# Altium schematic sheet fpga_bank34.SchDoc: FPGA Bank 34
size A4; Organization: GPA Robotics; Revision: REV 0
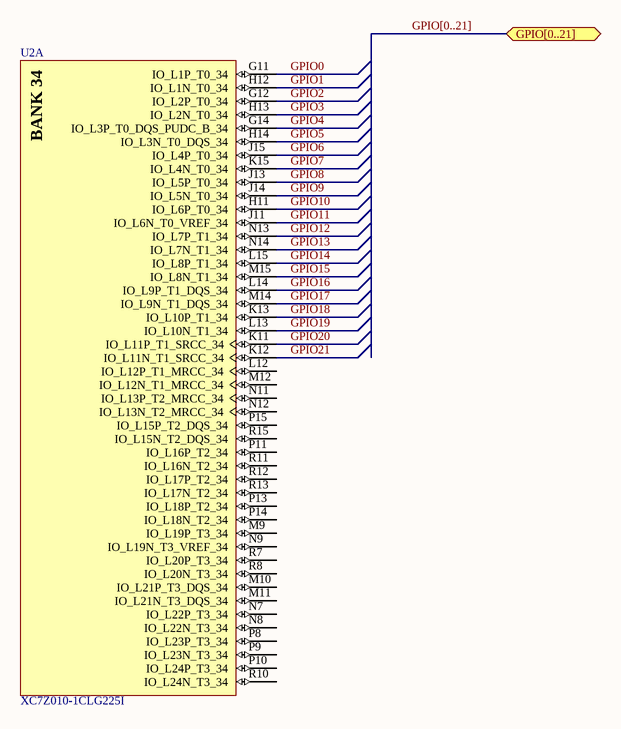
[diagram p0: fpga_bank34.SchDoc]

## Parts
U2  XC7Z010-1CLG225I  [CLG225]  (part A of 8)

## Ports
GPIO[0..21] (bidir)

## Nets
GPIO0: U2.G11(IO_L1P_T0_34)
GPIO1: U2.H12(IO_L1N_T0_34)
GPIO2: U2.G12(IO_L2P_T0_34)
GPIO3: U2.H13(IO_L2N_T0_34)
GPIO4: U2.G14(IO_L3P_T0_DQS_PUDC_B_34)
GPIO5: U2.H14(IO_L3N_T0_DQS_34)
GPIO6: U2.J15(IO_L4P_T0_34)
GPIO7: U2.K15(IO_L4N_T0_34)
GPIO8: U2.J13(IO_L5P_T0_34)
GPIO9: U2.J14(IO_L5N_T0_34)
GPIO10: U2.H11(IO_L6P_T0_34)
GPIO11: U2.J11(IO_L6N_T0_VREF_34)
GPIO12: U2.N13(IO_L7P_T1_34)
GPIO13: U2.N14(IO_L7N_T1_34)
GPIO14: U2.L15(IO_L8P_T1_34)
GPIO15: U2.M15(IO_L8N_T1_34)
GPIO16: U2.L14(IO_L9P_T1_DQS_34)
GPIO17: U2.M14(IO_L9N_T1_DQS_34)
GPIO18: U2.K13(IO_L10P_T1_34)
GPIO19: U2.L13(IO_L10N_T1_34)
GPIO20: U2.K11(IO_L11P_T1_SRCC_34)
GPIO21: U2.K12(IO_L11N_T1_SRCC_34)

Not connected (* = marked no-connect by the designer): U2 L12(IO_L12P_T1_MRCC_34) M9(IO_L19P_T3_34) M10(IO_L21P_T3_DQS_34) M11(IO_L21N_T3_DQS_34) M12(IO_L12N_T1_MRCC_34) N7(IO_L22P_T3_34) N8(IO_L22N_T3_34) N9(IO_L19N_T3_VREF_34) N11(IO_L13P_T2_MRCC_34) N12(IO_L13N_T2_MRCC_34) P8(IO_L23P_T3_34) P9(IO_L23N_T3_34) P10(IO_L24P_T3_34) P11(IO_L16P_T2_34) P13(IO_L18P_T2_34) P14(IO_L18N_T2_34) P15(IO_L15P_T2_DQS_34) R7(IO_L20P_T3_34) R8(IO_L20N_T3_34) R10(IO_L24N_T3_34) R11(IO_L16N_T2_34) R12(IO_L17P_T2_34) R13(IO_L17N_T2_34) R15(IO_L15N_T2_DQS_34)

## Buses and harness runs
bus GPIO[0..21] = port GPIO[0..21]

## Notes on the sheet
- Title
- Size:
- Date:
- A4
- Number:
- Time:
- Revision:
- Sheet
- of
- Repo:
- (in symbol CMP-0382-00001-1, part A) BANK 34

## Library data of the parts
U2 = CMP-0382-00001-1: 667 MHz Zynq™-7000 AP SoC, 88 PS I/O, 54 FPGA I/O, 225-Ball BGA, Speed Grade 1, Industrial Grade, Pb-Free; LUTs: 17600; Extensible Block RAM (# 36Kb Blocks): 240 KB (60); Speed Grade: -1; Flip Flops: 35200; DatasheetVersion: v1.2; ComponentLink4Description: Package File; ComponentLink1URL: http://www.xilinx.com/support/documentation/data_sheets/ds190-Zynq-7000-Overview.pdf; ComponentLink5URL: http://www.xilinx.com/support/documentation/user_guides/ug865-Zynq-7000-Pkg-Pinout.pdf; ComponentLink5Description: Packaging and Pinout; PartNumber: XC7Z010-1CLG225I; PackageVersion: Rev 1.2, 02/2013; ComponentLink3Description: DC and AC Switching Characteristics; ComponentLink2URL: http://www.xilinx.com/support/documentation/user_guides/ug865-Zynq-7000-Pkg-Pinout.pdf; ComponentLink3URL: http://www.xilinx.com/support/documentation/data_sheets/ds187-XC7Z010-XC7Z020-Data-Sheet.pdf; ComponentLink6URL: http://www.xilinx.com/support/documentation/user_guides/ug483_7Series_PCB.pdf; ComponentLink2Description: Package Specification; PackageReference: CLG225; ComponentLink1Description: Datasheet; ComponentLink4URL: http://www.xilinx.com/support/packagefiles/z7packages/xc7z010clg225pkg.txt; Generic Part Number: XC7Z010; ComponentLink6Description: PCB and Layout Guide; Mounting Technology: Surface Mount; PackageDescription: Wire-Bond Chip-Scale BGA, Body 13 x 13 mm, 0.8 mm Pitch; Code_JEDEC: MO-275-HHAC-1; RoHS: Pb-Free